# EAGLE schematic fCPU.Controller1 (EAGLE 7.6.0)
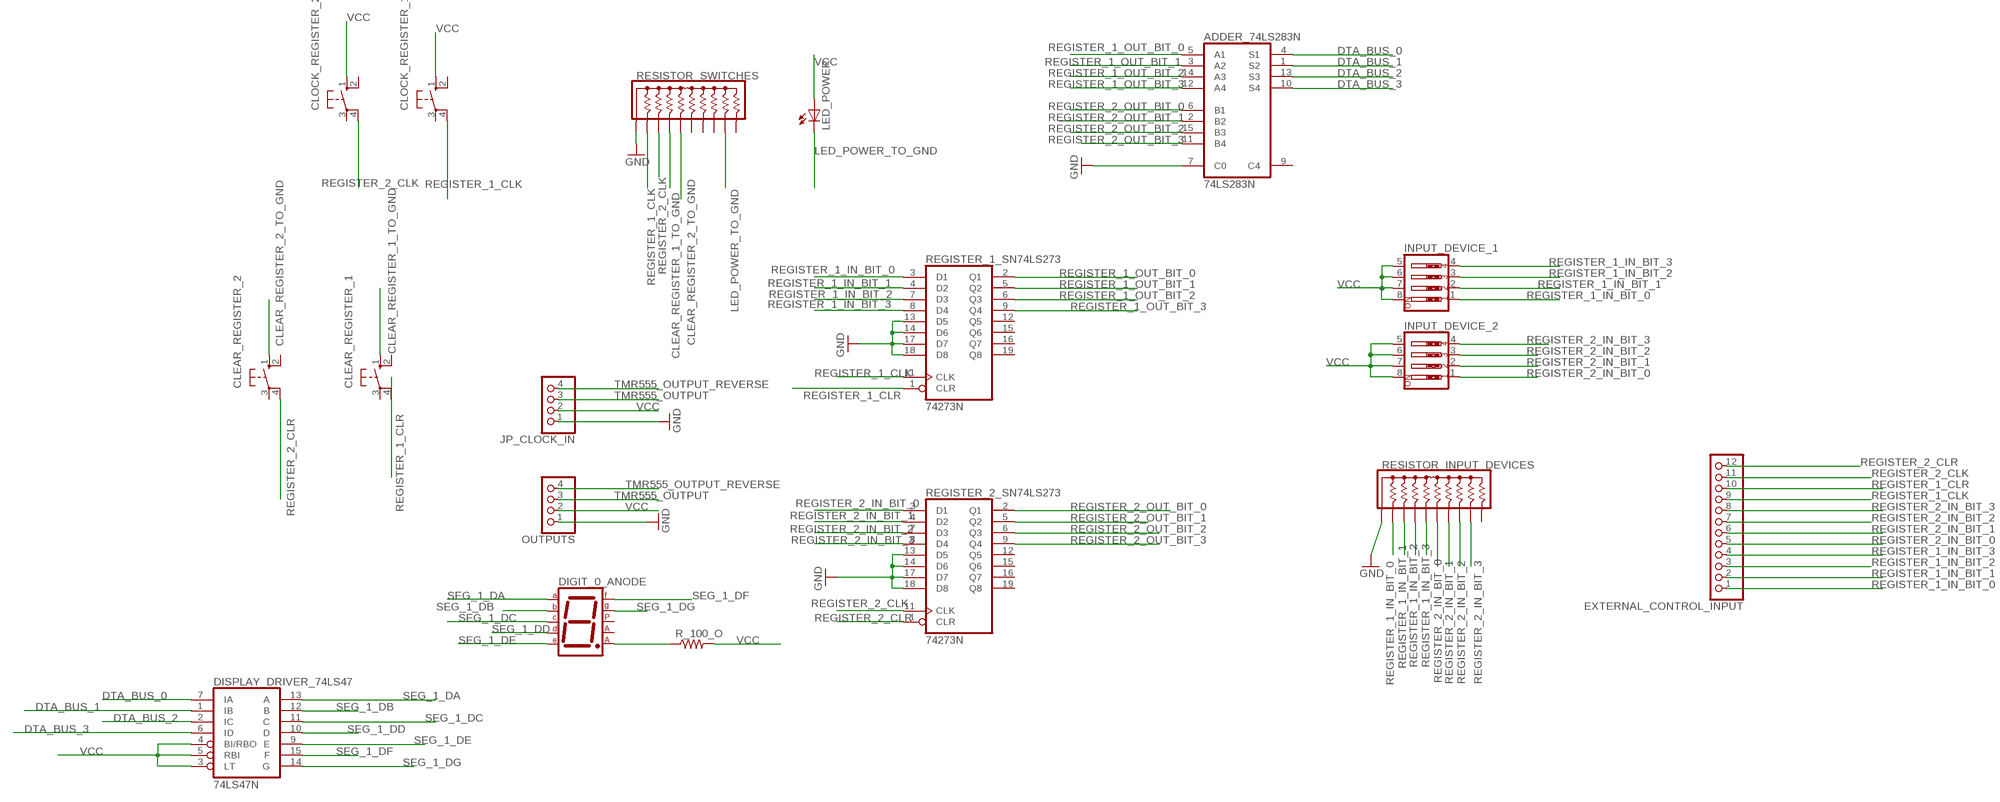
[diagram p0: schematic, sheet 1]

## Parts
ADDER_74LS283N  74LS283N  [DIL16]
CLEAR_REGISTER_1  10-XX  [B3F-10XX]
CLEAR_REGISTER_2  10-XX  [B3F-10XX]
CLOCK_REGISTER_1  10-XX  [B3F-10XX]
CLOCK_REGISTER_2  10-XX  [B3F-10XX]
DIGIT_0_ANODE  7SEG-CA  [7SEG-13]
DISPLAY_DRIVER_74LS47  74LS47N  [DIL16]
EXTERNAL_CONTROL_INPUT  PINHD-1X12  [1X12]
INPUT_DEVICE_1  SW_DIP-4  [EDG-04]
INPUT_DEVICE_2  SW_DIP-4  [EDG-04]
JP_CLOCK_IN  PINHD-1X4  [1X04]
LED_POWER  LEDSMT1206  [1206]
OUTPUTS  PINHD-1X4  [1X04]
R_100_O  R-US_R1206  [R1206]
REGISTER_1_SN74LS273  74273N  [DIL20]
REGISTER_2_SN74LS273  74273N  [DIL20]
RESISTOR_INPUT_DEVICES  4610X  [SIP10]
RESISTOR_SWITCHES  4610X  [SIP10]

## Nets
CLEAR_REGISTER_1_TO_GND: CLEAR_REGISTER_1.1(S) RESISTOR_SWITCHES.4
CLEAR_REGISTER_2_TO_GND: CLEAR_REGISTER_2.1(S) RESISTOR_SWITCHES.5
DTA_BUS_0: ADDER_74LS283N.4(S1) DISPLAY_DRIVER_74LS47.7(IA)
DTA_BUS_1: ADDER_74LS283N.1(S2) DISPLAY_DRIVER_74LS47.1(IB)
DTA_BUS_2: ADDER_74LS283N.13(S3) DISPLAY_DRIVER_74LS47.2(IC)
DTA_BUS_3: ADDER_74LS283N.10(S4) DISPLAY_DRIVER_74LS47.6(ID)
GND: ADDER_74LS283N.7(C0) JP_CLOCK_IN.1 OUTPUTS.1 REGISTER_1_SN74LS273.13(D5) REGISTER_1_SN74LS273.14(D6) REGISTER_1_SN74LS273.17(D7) REGISTER_1_SN74LS273.18(D8) REGISTER_2_SN74LS273.13(D5) REGISTER_2_SN74LS273.14(D6) REGISTER_2_SN74LS273.17(D7) REGISTER_2_SN74LS273.18(D8) RESISTOR_INPUT_DEVICES.1 RESISTOR_SWITCHES.1
LED_POWER_TO_GND: LED_POWER.C RESISTOR_SWITCHES.9
N$1: DIGIT_0_ANODE.8(CA2) R_100_O.1
REGISTER_1_CLK: CLOCK_REGISTER_1.4(P1) EXTERNAL_CONTROL_INPUT.9 REGISTER_1_SN74LS273.11(CLK) RESISTOR_SWITCHES.2
REGISTER_1_CLR: CLEAR_REGISTER_1.4(P1) EXTERNAL_CONTROL_INPUT.10 REGISTER_1_SN74LS273.1(CLR)
REGISTER_1_IN_BIT_0: EXTERNAL_CONTROL_INPUT.1 INPUT_DEVICE_1.1 REGISTER_1_SN74LS273.3(D1) RESISTOR_INPUT_DEVICES.2
REGISTER_1_IN_BIT_1: EXTERNAL_CONTROL_INPUT.2 INPUT_DEVICE_1.2 REGISTER_1_SN74LS273.4(D2) RESISTOR_INPUT_DEVICES.3
REGISTER_1_IN_BIT_2: EXTERNAL_CONTROL_INPUT.3 INPUT_DEVICE_1.3 REGISTER_1_SN74LS273.7(D3) RESISTOR_INPUT_DEVICES.4
REGISTER_1_IN_BIT_3: EXTERNAL_CONTROL_INPUT.4 INPUT_DEVICE_1.4 REGISTER_1_SN74LS273.8(D4) RESISTOR_INPUT_DEVICES.5
REGISTER_1_OUT_BIT_0: ADDER_74LS283N.5(A1) REGISTER_1_SN74LS273.2(Q1)
REGISTER_1_OUT_BIT_1: ADDER_74LS283N.3(A2) REGISTER_1_SN74LS273.5(Q2)
REGISTER_1_OUT_BIT_2: ADDER_74LS283N.14(A3) REGISTER_1_SN74LS273.6(Q3)
REGISTER_1_OUT_BIT_3: ADDER_74LS283N.12(A4) REGISTER_1_SN74LS273.9(Q4)
REGISTER_2_CLK: CLOCK_REGISTER_2.4(P1) EXTERNAL_CONTROL_INPUT.11 REGISTER_2_SN74LS273.11(CLK) RESISTOR_SWITCHES.3
REGISTER_2_CLR: CLEAR_REGISTER_2.4(P1) EXTERNAL_CONTROL_INPUT.12 REGISTER_2_SN74LS273.1(CLR)
REGISTER_2_IN_BIT_0: EXTERNAL_CONTROL_INPUT.5 INPUT_DEVICE_2.1 REGISTER_2_SN74LS273.3(D1) RESISTOR_INPUT_DEVICES.6
REGISTER_2_IN_BIT_1: EXTERNAL_CONTROL_INPUT.6 INPUT_DEVICE_2.2 REGISTER_2_SN74LS273.4(D2) RESISTOR_INPUT_DEVICES.7
REGISTER_2_IN_BIT_2: EXTERNAL_CONTROL_INPUT.7 INPUT_DEVICE_2.3 REGISTER_2_SN74LS273.7(D3) RESISTOR_INPUT_DEVICES.8
REGISTER_2_IN_BIT_3: EXTERNAL_CONTROL_INPUT.8 INPUT_DEVICE_2.4 REGISTER_2_SN74LS273.8(D4) RESISTOR_INPUT_DEVICES.9
REGISTER_2_OUT_BIT_0: ADDER_74LS283N.6(B1) REGISTER_2_SN74LS273.2(Q1)
REGISTER_2_OUT_BIT_1: ADDER_74LS283N.2(B2) REGISTER_2_SN74LS273.5(Q2)
REGISTER_2_OUT_BIT_2: ADDER_74LS283N.15(B3) REGISTER_2_SN74LS273.6(Q3)
REGISTER_2_OUT_BIT_3: ADDER_74LS283N.11(B4) REGISTER_2_SN74LS273.9(Q4)
SEG_1_DA: DIGIT_0_ANODE.7(A) DISPLAY_DRIVER_74LS47.13(A)
SEG_1_DB: DIGIT_0_ANODE.6(B) DISPLAY_DRIVER_74LS47.12(B)
SEG_1_DC: DIGIT_0_ANODE.4(C) DISPLAY_DRIVER_74LS47.11(C)
SEG_1_DD: DIGIT_0_ANODE.2(D) DISPLAY_DRIVER_74LS47.10(D)
SEG_1_DE: DIGIT_0_ANODE.1(E) DISPLAY_DRIVER_74LS47.9(E)
SEG_1_DF: DIGIT_0_ANODE.9(F) DISPLAY_DRIVER_74LS47.15(F)
SEG_1_DG: DIGIT_0_ANODE.10(G) DISPLAY_DRIVER_74LS47.14(G)
TMR555_OUTPUT: JP_CLOCK_IN.3 OUTPUTS.3
TMR555_OUTPUT_REVERSE: JP_CLOCK_IN.4 OUTPUTS.4
VCC: CLOCK_REGISTER_1.1(S) CLOCK_REGISTER_2.1(S) DISPLAY_DRIVER_74LS47.3(LT) DISPLAY_DRIVER_74LS47.4(BI/RBO) DISPLAY_DRIVER_74LS47.5(RBI) INPUT_DEVICE_1.5 INPUT_DEVICE_1.6 INPUT_DEVICE_1.7 INPUT_DEVICE_1.8 INPUT_DEVICE_2.5 INPUT_DEVICE_2.6 INPUT_DEVICE_2.7 INPUT_DEVICE_2.8 JP_CLOCK_IN.2 LED_POWER.A OUTPUTS.2 R_100_O.2
Unconnected: ADDER_74LS283N.9(C4) CLEAR_REGISTER_1.2(S1) CLEAR_REGISTER_1.3(P) CLEAR_REGISTER_2.2(S1) CLEAR_REGISTER_2.3(P) CLOCK_REGISTER_1.2(S1) CLOCK_REGISTER_1.3(P) CLOCK_REGISTER_2.2(S1) CLOCK_REGISTER_2.3(P) DIGIT_0_ANODE.3(CA1) DIGIT_0_ANODE.5(DP) REGISTER_1_SN74LS273.12(Q5) REGISTER_1_SN74LS273.15(Q6) REGISTER_1_SN74LS273.16(Q7) REGISTER_1_SN74LS273.19(Q8) REGISTER_2_SN74LS273.12(Q5) REGISTER_2_SN74LS273.15(Q6) REGISTER_2_SN74LS273.16(Q7) REGISTER_2_SN74LS273.19(Q8) RESISTOR_INPUT_DEVICES.10 RESISTOR_SWITCHES.6 RESISTOR_SWITCHES.7 RESISTOR_SWITCHES.8 RESISTOR_SWITCHES.10

## Power pins joined to a net without a drawn wire
GND: ADDER_74LS283N.8(GND) DISPLAY_DRIVER_74LS47.8(GND) REGISTER_1_SN74LS273.10(GND) REGISTER_2_SN74LS273.10(GND)
VCC: ADDER_74LS283N.16(VCC) DISPLAY_DRIVER_74LS47.16(VCC) REGISTER_1_SN74LS273.20(VCC) REGISTER_2_SN74LS273.20(VCC)

## Library data of the parts
ADDER_74LS283N = 74xx-us:74*283: 4-bit binary FULL ADDER, fast carry
CLEAR_REGISTER_1 CLEAR_REGISTER_2 CLOCK_REGISTER_1 CLOCK_REGISTER_2 = switch-omron:10-XX: OMRON SWITCH; MPN: B3F-1000; OC_FARNELL: 176432; OC_NEWARK: 36M3542
DIGIT_0_ANODE = special:7SEG-CA: 7-segment DISPLAY single anode, 13 mm
DISPLAY_DRIVER_74LS47 = 74xx-us:74*47: BCD to seven segment DECODER/DRIVER Source: http://www.ee.washington.edu/stores/DataSheets/74ls/74ls47.pdf
EXTERNAL_CONTROL_INPUT = adafruit:PINHD-1X12: PIN HEADER
INPUT_DEVICE_1 INPUT_DEVICE_2 = special:SW_DIP-4: DIP SWITCH
JP_CLOCK_IN OUTPUTS = pinhead:PINHD-1X4: PIN HEADER
LED_POWER = adafruit:LED: LED OSRAM: - CHIPLED LG R971, LG N971, LY N971, LG Q971, LY Q971, LO R971, LY R971 LH N974, LH R974 LS Q976, LO Q976, LY Q976 LO Q996 - Hyper CHIPLED LW Q18S LB Q993, LB Q99A, LB R99A - SideLED LS A670, LO A670, LY A670, LG A670, LP A670 LB A673, LV A673, LT A673, LW A673 LH A674 LY A675 LS A676, LA A676, LO A676, LY A676, LW A676 LS A679, LY A679, LG A679 - Hyper Micro SIDELED® LS Y876, LA Y876, LO Y876, LY Y876 LT Y87S - SmartLED LW L88C, LW L88S LB L89C, LB L89S, LG L890 LS L89K, LO L89K, LY L89K LS L896, LA L896, LO L896, LY L896 - TOPLED LS T670, LO T670, LY T670, LG T670, LP T670 LSG T670, LSP T670, LSY T670, LOP T670, LYG T670 LG T671, LOG T671, LSG T671 LB T673, LV T673, LT T673, LW T673 LH T674 LS T676, LA T676, LO T676, LY T676, LB T676, LH T676, LSB T676, LW T676 LB T67C, LV T67C, LT T67C, LS T67K, LO T67K, LY T67K, LW E67C LS E67B, LA E67B, LO E67B, LY E67B, LB E67C, LV E67C, LT E67C LW T67C LS T679, LY T679, LG T679 LS T770, LO T770, LY T770, LG T770, LP T770 LB T773, LV T773, LT T773, LW T773 LH T774 LS E675, LA E675, LY E675, LS T675 LS T776, LA T776, LO T776, LY T776, LB T776 LHGB T686 LT T68C, LB T68C - Hyper Mini TOPLED® LB M676 - Mini TOPLED Santana® LG M470 LS M47K, LO M47K, LY M47K Source: http://www.osram.convergy.de/
R_100_O = adafruit:R-US_: RESISTOR, American symbol
REGISTER_1_SN74LS273 REGISTER_2_SN74LS273 = 74xx-us:74*273: Octal D type FLIP FLOP, clear
RESISTOR_INPUT_DEVICES RESISTOR_SWITCHES = resistor-sip:4610X: Bourns 4600X Series - Thick Film Conformal SIPs 4610X-101 Resistor Network Configuration: 101 (Bussed Resistors) Resistance range: 10 ohms to 10 Megaohms Maximum Operating Voltage: 100V Source: http://www.bourns.com/ProductLine.aspx?name=standard_thick_film_networks PDF: http://www.bourns.com/data/global/pdfs/4600X.pdf